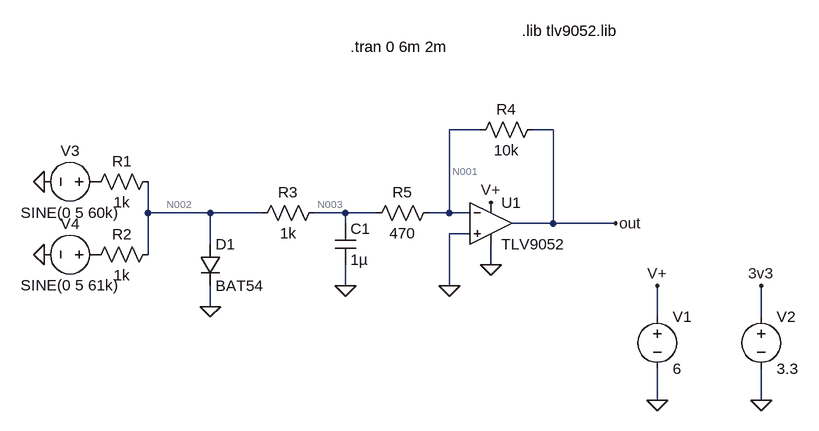
[diagram p0: schematic Mixer.asc]
Mixer.asc, the LTspice schematic file:
Version 4.1
SHEET 1 1112 680
WIRE 384 128 336 128
WIRE 496 128 464 128
WIRE -128 256 -128 208
WIRE -32 256 -128 256
WIRE 48 256 -32 256
WIRE 176 256 128 256
WIRE 224 256 176 256
WIRE 336 256 336 128
WIRE 336 256 304 256
WIRE 368 256 336 256
WIRE 176 272 176 256
WIRE 496 272 496 128
WIRE 496 272 432 272
WIRE 592 272 496 272
WIRE 368 288 336 288
WIRE -32 304 -32 256
WIRE -128 320 -128 256
WIRE 400 336 400 304
WIRE 176 368 176 336
WIRE 336 368 336 288
WIRE -32 400 -32 368
WIRE 656 416 656 368
WIRE 816 416 816 368
WIRE 656 544 656 496
WIRE 816 544 816 496
FLAG 656 368 V+
FLAG 656 544 0
FLAG 592 272 out
FLAG 400 240 V+
FLAG 816 368 3v3
FLAG 816 544 0
FLAG 400 336 0
FLAG -288 208 0
FLAG -288 320 0
FLAG -32 400 0
FLAG 176 368 0
FLAG 336 368 0
SYMBOL voltage 656 400 R0
SYMATTR InstName V1
SYMATTR Value 6
SYMBOL res -112 192 R90
WINDOW 0 0 56 VBottom 2
WINDOW 3 32 56 VTop 2
SYMATTR InstName R1
SYMATTR Value 1k
SYMBOL res -112 304 R90
WINDOW 0 0 56 VBottom 2
WINDOW 3 32 56 VTop 2
SYMATTR InstName R2
SYMATTR Value 1k
SYMBOL diode -48 304 R0
SYMATTR InstName D1
SYMATTR Value BAT54
SYMBOL res 144 240 R90
WINDOW 0 0 56 VBottom 2
WINDOW 3 32 56 VTop 2
SYMATTR InstName R3
SYMATTR Value 1k
SYMBOL cap 160 272 R0
SYMATTR InstName C1
SYMATTR Value 1µ
SYMBOL OpAmps\\opamp2 400 208 R0
SYMATTR InstName U1
SYMATTR Value TLV9052
SYMBOL res 480 112 R90
WINDOW 0 0 56 VBottom 2
WINDOW 3 32 56 VTop 2
SYMATTR InstName R4
SYMATTR Value 10k
SYMBOL res 320 240 R90
WINDOW 0 0 56 VBottom 2
WINDOW 3 32 56 VTop 2
SYMATTR InstName R5
SYMATTR Value 470
SYMBOL voltage -192 208 R90
WINDOW 0 -32 56 VBottom 2
WINDOW 3 32 56 VTop 2
WINDOW 123 0 0 Left 0
WINDOW 39 0 0 Left 0
SYMATTR InstName V3
SYMATTR Value SINE(0 5 60k)
SYMBOL voltage -192 320 R90
WINDOW 0 -32 56 VBottom 2
WINDOW 3 32 56 VTop 2
WINDOW 123 0 0 Left 0
WINDOW 39 0 0 Left 0
SYMATTR InstName V4
SYMATTR Value SINE(0 5 61k)
SYMBOL voltage 816 400 R0
SYMATTR InstName V2
SYMATTR Value 3.3
TEXT 184 0 Left 2 !.tran 0 6m 2m
TEXT 448 -24 Left 2 !.lib tlv9052.lib

The netlist it stands for:
* Mixer.asc
V1 V+ 0 6
R1 N002 P001 1k
R2 N002 P002 1k
D1 N002 0 BAT54
R3 N003 N002 1k
C1 N003 0 1µ
X§U1 0 N001 V+ 0 out TLV9052  ; pins In+ In- V+ V- OUT
R4 out N001 10k
R5 N001 N003 470
V3 P001 0 SINE(0 5 60k)
V4 P002 0 SINE(0 5 61k)
V2 3v3 0 3.3
.model D D
.lib standard.dio
.tran 0 6m 2m
.lib tlv9052.lib
.backanno
.end

* Results of the author's LTspice run, read from the files saved beside the schematic
* Operating Point, zero values left out:
*   V(n002) = 725.1 µV
*   V(n003) = 2.178 mV
*   V(out) = 17.39 mV
*   V(v+) = 6 V
*   V(n001) = 2.861 mV
*   V(3v3) = 3.3 V
*   I(V1) = -331.5 µA
*   I(R2) = 725.1 nA
*   I(R3) = 1.453 µA
*   I(V3) = 725.1 nA
*   I(R4) = 1.453 µA
*   I(R5) = 1.453 µA
*   I(R1) = 725.1 nA
*   I(D1) = 2.843 nA
*   I(V4) = 725.1 nA
*   Ix(u1:in+) = -13 pA
*   Ix(u1:in-) = -13.99 pA
*   Ix(u1:vcc) = 331.5 µA
*   Ix(u1:vee) = -330 µA
*   Ix(u1:out) = -1.453 µA
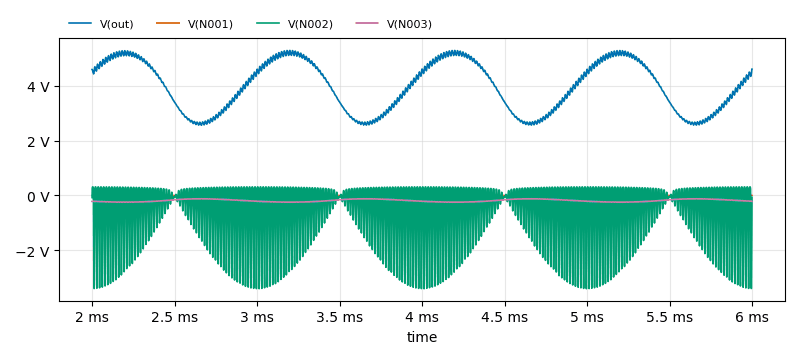
[diagram p1: Transient Analysis of Mixer.asc, plotted from the saved traces]
* Transient Analysis, 1 run:
*   V(out): min 2.564 V, max 5.295 V, average 3.98 V, rms 4.084 V, last 4.61 V
*   V(N001): min -1.376 mV, max 994 µV, average 314.4 µV, rms 729.2 µV, last 196.4 µV
*   V(N002): min -3.407 V, max 314.2 mV, average -584.8 mV, rms 1.229 V, last -72.57 mV
*   V(N003): min -248.7 mV, max -120.1 mV, average -186.7 mV, rms 191.6 mV, last -216.5 mV